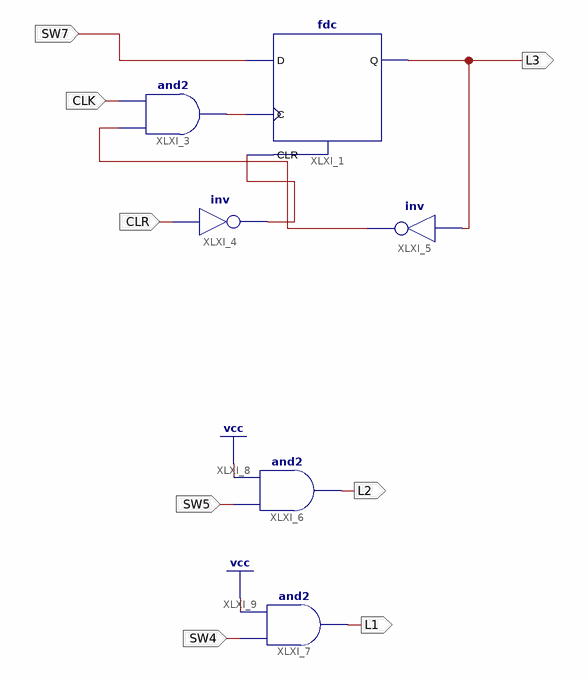
[diagram p0: schematic sheet 1]
// Xilinx ISE schematic ch3.sch (spartan6) as structural Verilog: 6 symbols, 8 ports
module ch3 (
  input  SW7,
  input  CLK,
  input  CLR,
  input  SW4,
  input  SW5,
  output L3,
  output L1,
  output L2
);

  wire XLXN_2, XLXN_3, XLXN_4;

  fdc XLXI_1 (.C(XLXN_2), .CLR(XLXN_3), .D(SW7), .Q(L3));
  and XLXI_3 (XLXN_2, XLXN_4, CLK);
  not XLXI_4 (XLXN_3, CLR);
  not XLXI_5 (XLXN_4, L3);
  and XLXI_6 (L2, SW5, 1'b1);
  and XLXI_7 (L1, SW4, 1'b1);
endmodule
